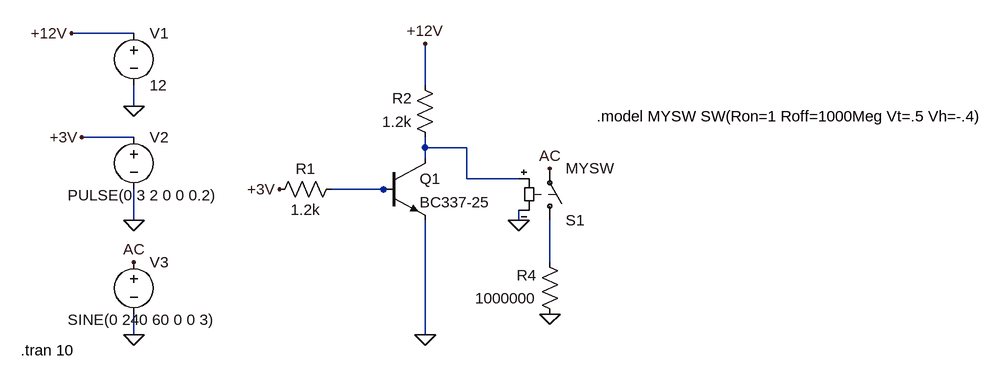
[diagram p0: schematic relay control.asc]
relay control.asc, the LTspice schematic file:
Version 4
SHEET 1 880 680
WIRE -832 -112 -928 -112
WIRE -384 -32 -384 -96
WIRE -832 0 -832 -32
WIRE -832 48 -912 48
WIRE -384 64 -384 48
WIRE -320 64 -384 64
WIRE -384 80 -384 64
WIRE -320 112 -320 64
WIRE -240 112 -320 112
WIRE -448 128 -528 128
WIRE -432 128 -448 128
WIRE -832 176 -832 128
WIRE -240 176 -240 160
WIRE -192 240 -192 176
WIRE -832 352 -832 320
WIRE -384 352 -384 176
FLAG -384 352 0
FLAG -832 176 0
FLAG -832 0 0
FLAG -928 -112 +12V
FLAG -912 48 +3V
FLAG -384 -96 +12V
FLAG -608 128 +3V
FLAG -832 352 0
FLAG -832 240 AC
FLAG -240 176 0
FLAG -192 320 0
FLAG -192 96 AC
SYMBOL res -512 112 R90
WINDOW 0 0 56 VBottom 2
WINDOW 3 32 56 VTop 2
SYMATTR InstName R1
SYMATTR Value 1.2k
SYMBOL voltage -832 -128 R0
WINDOW 123 0 0 Left 0
WINDOW 39 0 0 Left 0
SYMATTR InstName V1
SYMATTR Value 12
SYMBOL voltage -832 32 R0
WINDOW 3 -102 105 Left 2
WINDOW 123 0 0 Left 0
WINDOW 39 0 0 Left 0
SYMATTR InstName V2
SYMATTR Value PULSE(0 3 2 0 0 0.2)
SYMBOL npn -448 80 R0
SYMATTR InstName Q1
SYMATTR Value BC337-25
SYMBOL res -368 64 R180
WINDOW 0 36 76 Left 2
WINDOW 3 36 40 Left 2
SYMATTR InstName R2
SYMATTR Value 1.2k
SYMBOL voltage -832 224 R0
WINDOW 3 -102 105 Left 2
WINDOW 123 0 0 Left 0
WINDOW 39 0 0 Left 0
SYMATTR InstName V3
SYMATTR Value SINE(0 240 60 0 0 3)
SYMBOL sw -192 192 M180
SYMATTR InstName S1
SYMATTR Value MYSW
SYMBOL res -176 336 R180
WINDOW 0 36 76 Left 2
WINDOW 3 36 40 Left 2
SYMATTR InstName R4
SYMATTR Value 1000000
TEXT -1006 376 Left 2 !.tran 10
TEXT -120 16 Left 2 !.model MYSW SW(Ron=1 Roff=1000Meg Vt=.5 Vh=-.4)

The netlist it stands for:
* relay control.asc
R1 N002 +3V 1.2k
V1 +12V 0 12
V2 +3V 0 PULSE(0 3 2 0 0 0.2)
Q1 N001 N002 0 0 BC337-25
R2 N001 +12V 1.2k
V3 AC 0 SINE(0 240 60 0 0 3)
S1 N003 AC N001 0 MYSW
R4 0 N003 1000000
.model NPN NPN
.model PNP PNP
.lib standard.bjt
.tran 10
.model MYSW SW(Ron=1 Roff=1000Meg Vt=.5 Vh=-.4)
.backanno
.end